# Altium schematic sheet BSPD.SchDoc
size A
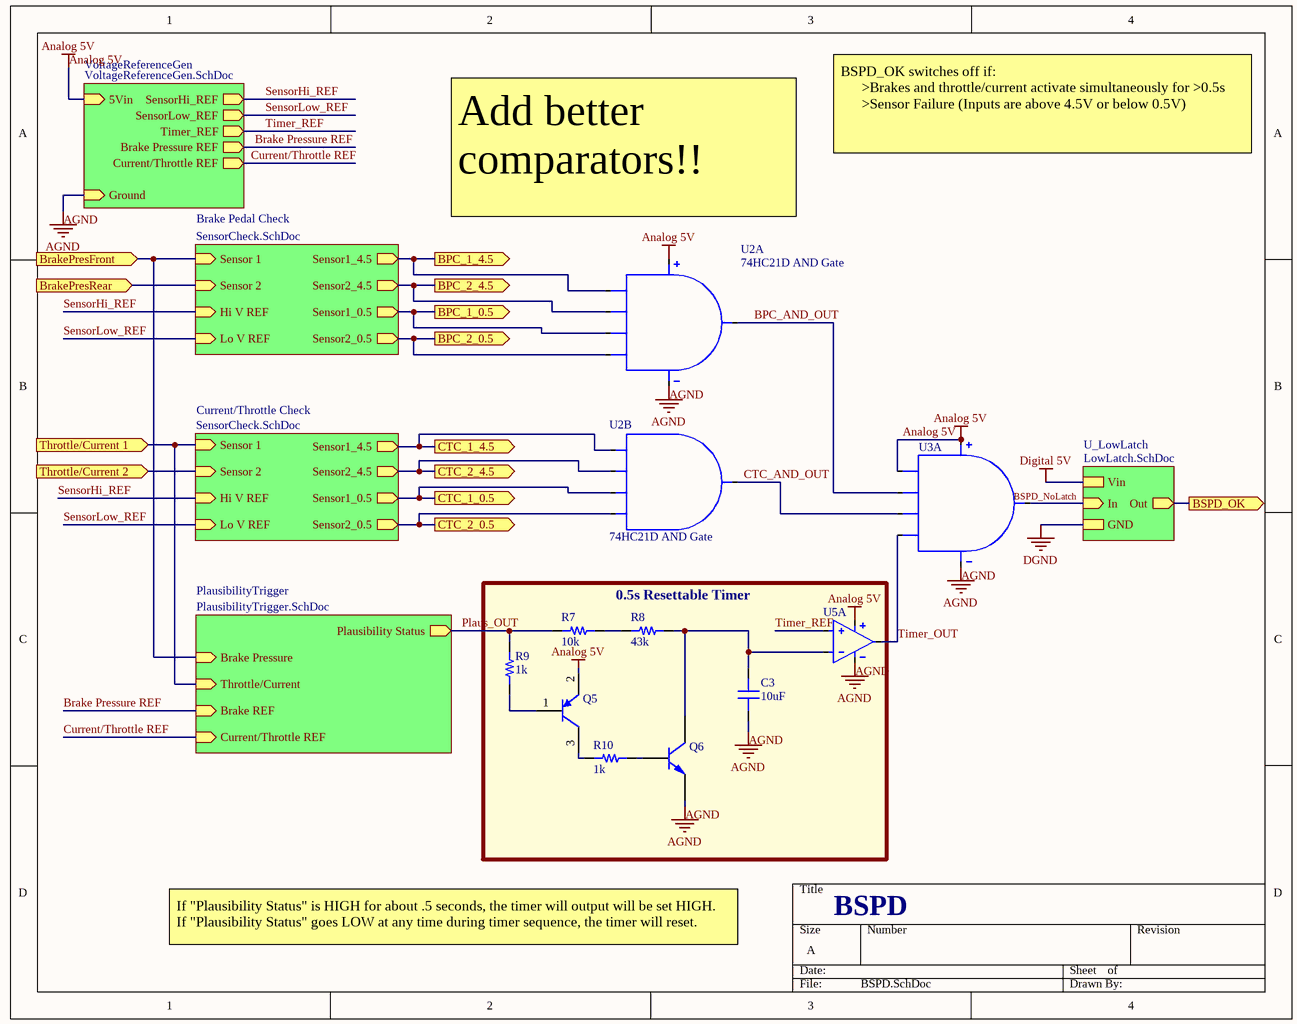
[diagram p0: BSPD.SchDoc]

## Parts
C3  capacitance: 10uF  [0603]  (hidden comment: capacitor)
Q5  2SB815-6-TB-E_PNP  [SOT23-3]  (value not drawn)
Q6  MMBT4401  [SOT23-3]  (value not drawn)
R7  resistance: 10k  [RES 0603/1608]  (hidden comment: resistor)
R8  resistance: 43k  [RES 0603/1608]  (hidden comment: resistor)
R9  resistance: 1k  [RES 0603/1608]  (hidden comment: resistor)
R10  resistance: 1k  [RES 0603/1608]  (hidden comment: resistor)
U2  74HC21D AND Gate  [SOT108-1]  (parts A,B of 2)
U3  (no value)  [SOT108-1]  (part A of 2)
U5  TS3704CDT  [SOIC-14]  (value not drawn)  (part A of 4)

## Blocks framed on the sheet
0.5s Resettable Timer: C3 Q5 Q6 R7-R10 U5

## Sub-sheets
Brake Pedal Check = SensorCheck.SchDoc: Sensor 1 (in), Sensor 2 (in), Sensor1_4.5 (out), Sensor2_4.5 (out), Sensor1_0.5 (out), Sensor2_0.5 (out), Hi V REF (in), Lo V REF (in)
Current/Throttle Check = SensorCheck.SchDoc: Sensor 1 (in), Sensor 2 (in), Sensor1_4.5 (out), Sensor2_0.5 (out), Sensor1_0.5 (out), Sensor2_4.5 (out), Lo V REF (in), Hi V REF (in)
PlausibilityTrigger = PlausibilityTrigger.SchDoc: Plausibility Status (out), Brake REF (in), Throttle/Current (in), Brake Pressure (in), Current/Throttle REF (in)
U_LowLatch = LowLatch.SchDoc: Vin, In (in), GND, Out (out)
VoltageReferenceGen = VoltageReferenceGen.SchDoc: Ground (in), 5Vin (in), Brake Pressure REF (out), Current/Throttle REF (out), SensorLow_REF (out), SensorHi_REF (out), Timer_REF (out)

## Ports
BPC_1_0.5 (out), BPC_1_4.5 (out), BPC_2_0.5 (out), BPC_2_4.5 (out), BrakePresFront (in), BrakePresRear (in), BSPD_OK (out), CTC_1_0.5 (out), CTC_1_4.5 (out), CTC_2_0.5 (out), CTC_2_4.5 (out), Throttle/Current 1 (in), Throttle/Current 2 (in)

## Nets
AGND: C3.1 Q6.2(E) U2.7(GND) U3.7(GND) U5.12(V-) ; sheet VoltageReferenceGen/Ground
Analog 5V: Q5.2(E) U2.14(Vcc) U3.1(1A) U3.14(Vcc) U5.3(V+) ; sheet VoltageReferenceGen/5Vin
DGND: sheet U_LowLatch/GND
Digital 5V: sheet U_LowLatch/Vin
BPC_1_0.5: U2.4(1C) ; port BPC_1_0.5, sheet Brake Pedal Check/Sensor1_0.5
BPC_1_4.5: U2.1(1A) ; port BPC_1_4.5, sheet Brake Pedal Check/Sensor1_4.5
BPC_2_0.5: U2.5(1D) ; port BPC_2_0.5, sheet Brake Pedal Check/Sensor2_0.5
BPC_2_4.5: U2.2(1B) ; port BPC_2_4.5, sheet Brake Pedal Check/Sensor2_4.5
BPC_AND_OUT: U2.6(1Y) U3.2(1B)
Brake Pressure REF: sheet PlausibilityTrigger/Brake REF, sheet VoltageReferenceGen/Brake Pressure REF
BrakePresFront: port BrakePresFront, sheet Brake Pedal Check/Sensor 1, sheet PlausibilityTrigger/Brake Pressure
BrakePresRear: port BrakePresRear, sheet Brake Pedal Check/Sensor 2
BSPD_NoLatch: U3.6(1Y) ; sheet U_LowLatch/In
BSPD_OK: port BSPD_OK, sheet U_LowLatch/Out
CTC_1_0.5: U2.12(2C) ; port CTC_1_0.5, sheet Current/Throttle Check/Sensor1_0.5
CTC_1_4.5: U2.9(2A) ; port CTC_1_4.5, sheet Current/Throttle Check/Sensor1_4.5
CTC_2_0.5: U2.13(2D) ; port CTC_2_0.5, sheet Current/Throttle Check/Sensor2_0.5
CTC_2_4.5: U2.10(2B) ; port CTC_2_4.5, sheet Current/Throttle Check/Sensor2_4.5
CTC_AND_OUT: U2.8(2Y) U3.4(1C)
Current/Throttle REF: sheet PlausibilityTrigger/Current/Throttle REF, sheet VoltageReferenceGen/Current/Throttle REF
Plaus_OUT: R7.1 R9.1 ; sheet PlausibilityTrigger/Plausibility Status
SensorHi_REF: sheet Brake Pedal Check/Hi V REF, sheet Current/Throttle Check/Hi V REF, sheet VoltageReferenceGen/SensorHi_REF
SensorLow_REF: sheet Brake Pedal Check/Lo V REF, sheet Current/Throttle Check/Lo V REF, sheet VoltageReferenceGen/SensorLow_REF
Throttle/Current 1: port Throttle/Current 1, sheet Current/Throttle Check/Sensor 1, sheet PlausibilityTrigger/Throttle/Current
Throttle/Current 2: port Throttle/Current 2, sheet Current/Throttle Check/Sensor 2
Timer_OUT: U3.5(1D) U5.2(OUT_1)
Timer_REF: U5.5(+IN_1) ; sheet VoltageReferenceGen/Timer_REF
NetC3_2: C3.2 Q6.3(C) R8.2 U5.4(-IN_1)
NetQ5_1: Q5.1(B) R9.2
NetQ5_3: Q5.3(C) R10.1
NetQ6_1: Q6.1(B) R10.2
NetR7_2: R7.2 R8.1

## Notes on the sheet
- BSPD_OK switches off if:
  >Brakes and throttle/current activate simultaneously for >0.5s
  >Sensor Failure (Inputs are above 4.5V or below 0.5V)
- (near U2) Add better comparators!!
- If "Plausibility Status" is HIGH for about .5 seconds, the timer will output will be set HIGH.
  If "Plausibility Status" goes LOW at any time during timer sequence, the timer will reset.
- BSPD

## Library data of the parts
C3 = 1: Generic 0603 capacitor; id: 1; voltage: 50; dielectric: Ceramic; percent tolerance: 10; name: 0603 Capacitor; ESR: 1; package: 0603; quantity: 0
Q5 = 8: id: 8; name: 2SB815-6-TB-E PNP; type: PNP; beta: 200; ic: 0.699999988079071; vcemax: 15; package: SMT 3-CP; quantity: 0; link: https://www.digikey.com/product-detail/en/on-semiconductor/2SB815-6-TB-E/2SB815-6-TB-EOSCT-ND/8538307
Q6 = 2: id: 2; type: NPN; name: MMBT4401; quantity: 0; link: https://www.digikey.com/product-detail/en/on-semiconductor/MMBT4401/MMBT4401FSCT-ND/458974?utm_adgroup=Semiconductor%20Modules&slid=&gclid=Cj0KCQiAuf7fBRD7ARIsACqb8w6hHKWa-dWJhBKA9_nL8g4V_vyaEG2IBNoQt05KILQ9xMZ9NiOMdTcaAtxTEALw_wcB
R7-R10 = 1: id: 1; name: 0603 Resistor; percent tolerance: 5; package: 0603; quantity: 0
U2 = 15: 74HC21D_AND_Gate; id: 15; DualAND: CTC; quantity: 0
U3 = 15: 74HC21D_AND_Gate; id: 15; DualAND: Plaus+BSPDAND; quantity: 0
U5 = 42: Quad CMOS Comparators; id: 42; vcc: 18; voltageinmax: 12; AnnotateREF: BSPD_Trig; name: TS3704CDT; package: SOIC-14; quantity: 0; link: https://www.digikey.com/product-detail/en/stmicroelectronics/TS3704CDT/497-4063-1-ND/720983; createdby: Kevin